# EAGLE design drawdio_v2 (EAGLE 9.0.1)
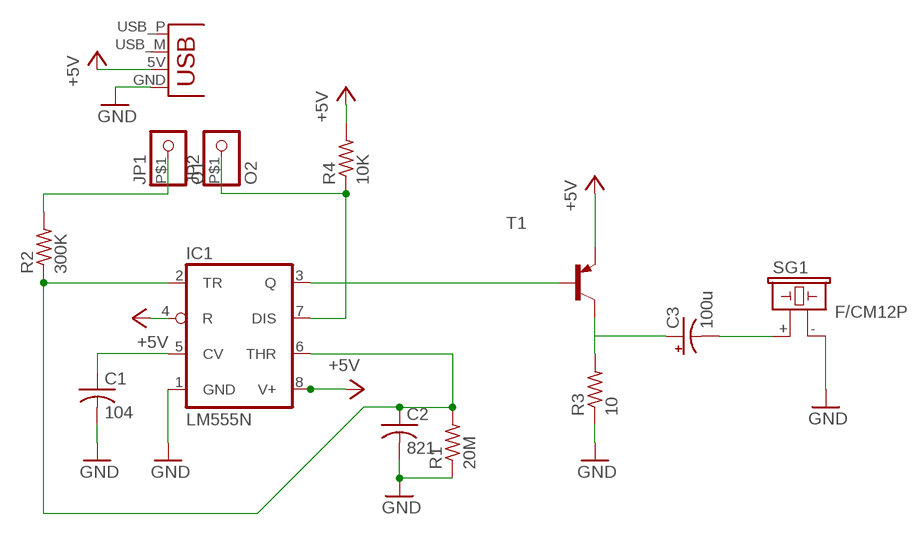
[diagram p0: schematic, sheet 1]

## Parts
C1  104  C-US025-030X050  [C025-030X050]
C2  821  C-US050-024X044  [C050-024X044]
C3  100u  CPOL-USE2,5-6E  [E2,5-6E]
IC1  LM555N  [DIL08]
JP1  O1  PINHD-1X1-BIGPOGO  [1X1-BIGPOGO]
JP2  O2  PINHD-1X1-BIGPOGO  [1X1-BIGPOGO]
R1  20M  R-US_0207/7  [0207/7]
R2  300K  R-US_0207/7  [0207/7]
R3  10  R-US_0207/7  [0207/7]
R4  10K  R-US_0207/7  [0207/7]
SG1  F/CM12P  [F/CM12P]
T1  MPS2907A-PNP-TO92-CBE  [TO92-CBE]
X1  USBPCB  [USB-A-PCB]

## Nets
+5V: IC1.4(R) IC1.8(V+) R4.2 T1.E X1.5V(VBUS)
GND: C1.2 C2.2 IC1.1(GND) R1.1 R3.1 SG1.- X1.GND
N$1: C1.1 IC1.5(CV)
N$2: C2.1 IC1.2(TR) IC1.6(THR) R1.2 R2.1
N$3: C3.- SG1.+
N$4: JP1.P$1 R2.2
N$5: IC1.7(DIS) JP2.P$1 R4.1
N$6: IC1.3(Q) T1.B
N$7: C3.+ R3.2 T1.C
Unconnected: X1.USB_M(D-) X1.USB_P(D+)

## Library data of the parts
C1 C2 = adafruit:C-US: CAPACITOR, American symbol
C3 = adafruit:CPOL-US: POLARIZED CAPACITOR, American symbol
IC1 = linear:*555: TIMER
JP1 JP2 = adafruit:PINHD-1X1: Pin header 1x1 for 0.1" spacing With round pins
R1-R4 = rcl:R-US_: RESISTOR, American symbol; SPICEPREFIX: R
SG1 = buzzer:F/CM12P: BUZZER Source: Buerklin; OC_FARNELL: unknown; OC_NEWARK: unknown
T1 = transistor:*-PNP-: PNP Transistror
X1 = SparkFun:USB: USB Connectors USB-B-PTH is fully proven SKU : PRT-00139 USB-miniB is fully proven SKU : PRT-00587 USB-A-PCB is untested. USB-A-H is throughly reviewed, but untested. Spark Fun Electronics SKU : PRT-00437 USB-B-SMT is throughly reviewed, but untested. Needs silkscreen touching up. USB-A-S has not been used/tested USB-MB-H has not been used/tested

## Board
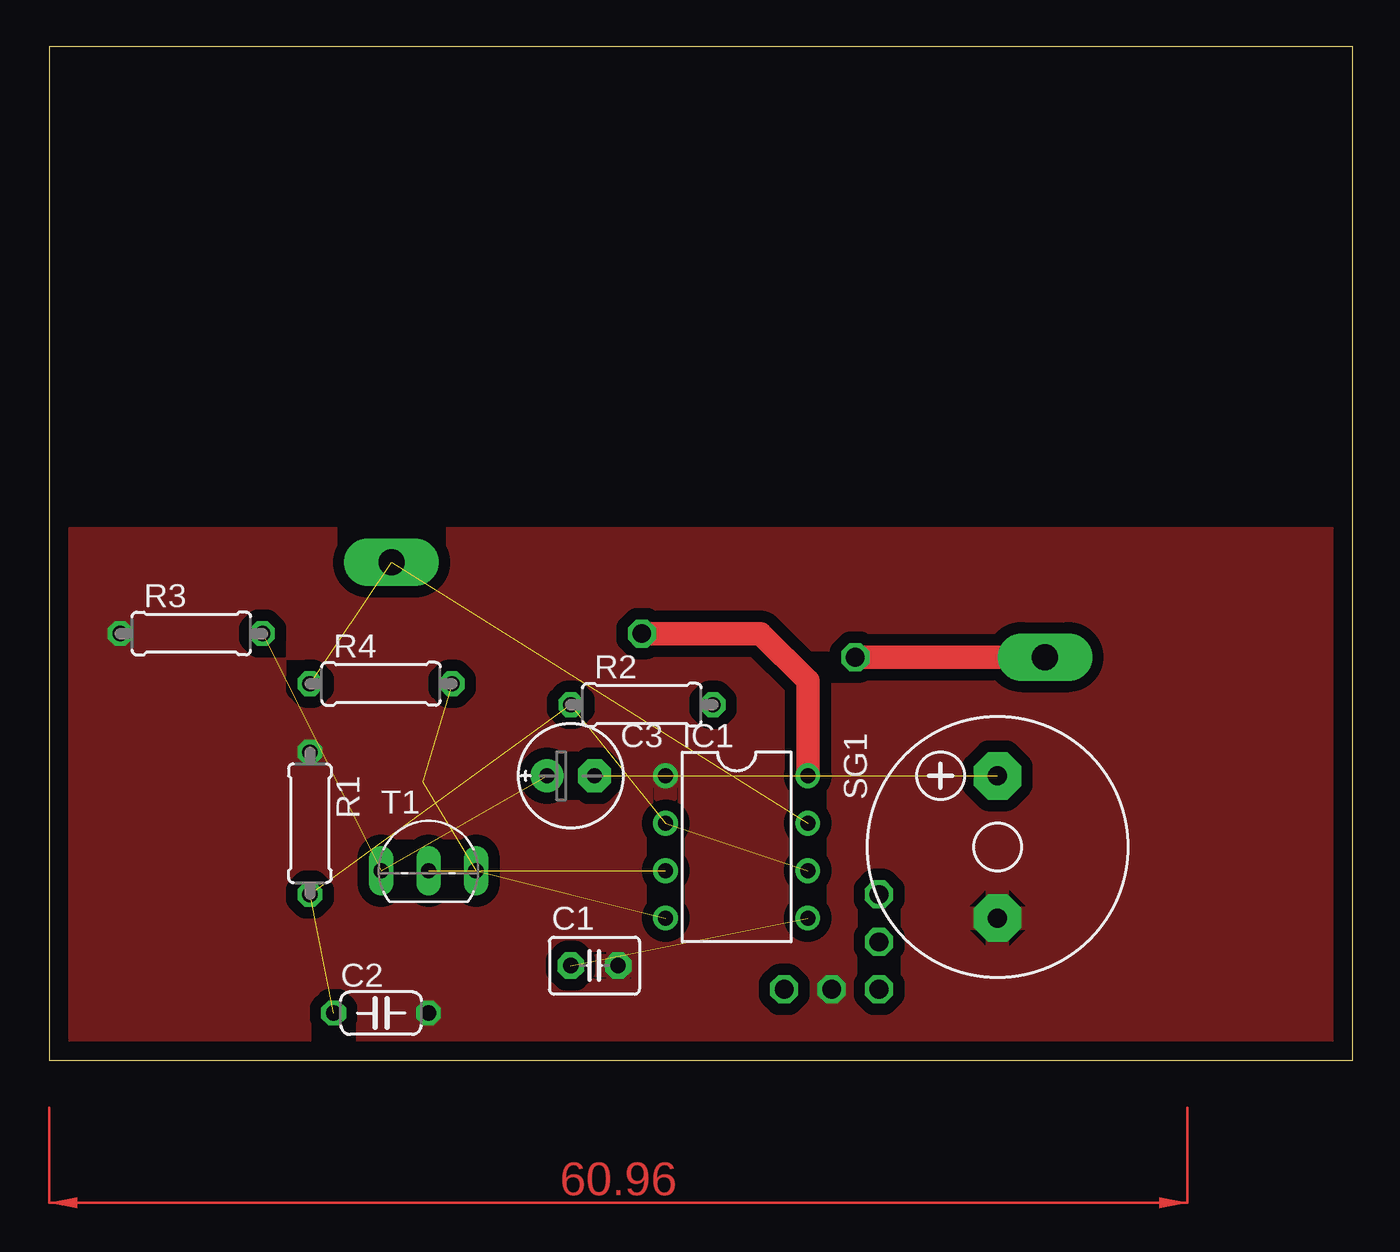
[diagram p1: board, top side]
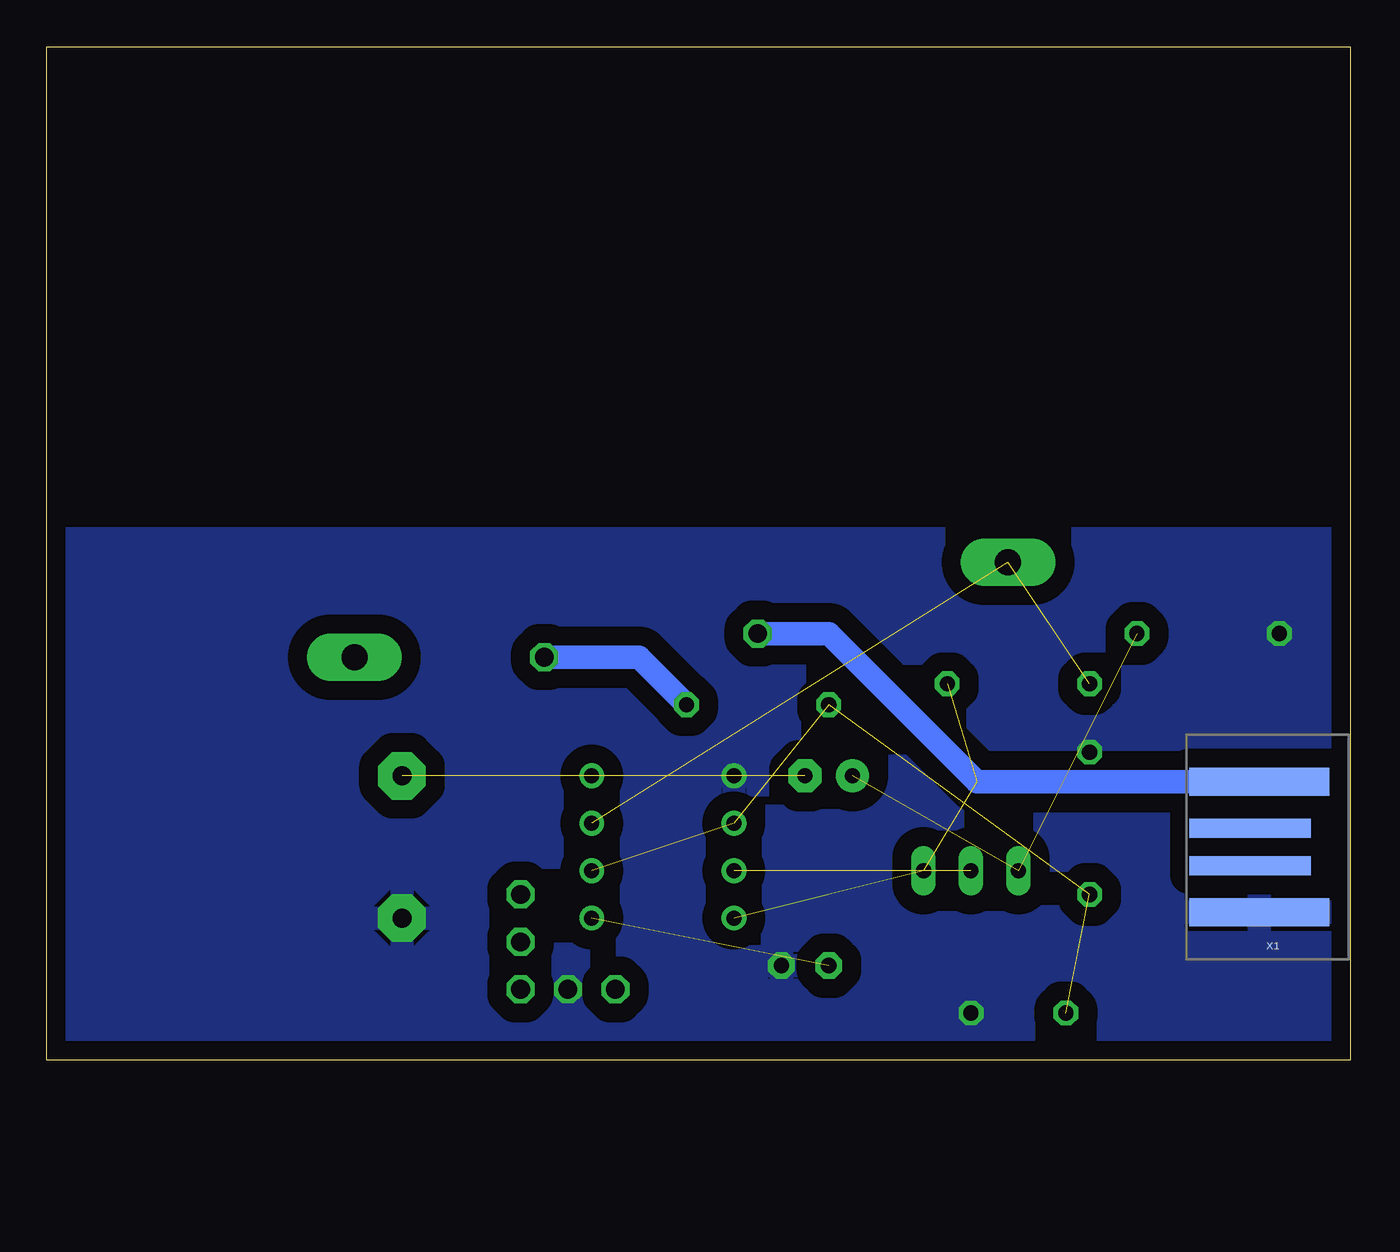
[diagram p2: board, bottom side, seen from below]

Size 69.83 x 54.28 mm. Coordinates in mm from the lower left corner, seen from the top.
Outline: 0,0 69.83,0 69.83,54.28 0,54.28 0,0
Copper layers (1*16): Top 0.035mm / dielectric 1.5mm / Bottom 0.035mm
Design rules "default": minimum track width 6mil, minimum drill 0.35mm, track to track 6mil, track to pad 6mil, pad to pad 6mil, via to via 6mil, smd to smd 6mil, copper to edge 40mil, drill to drill 6mil, minimum pad ring 10mil, minimum via ring 8mil, stop-mask expansion 4mil, vias tented up to drill 0mil, thermal gap 10mil

### Footprints (pad centres in the part's own frame; a part is rotated, then mirrored left to right if it is on the bottom)
C025-030X050 = drill 0.813 pad 1.422 octagon: 1 -1.27,0; 2 1.27,0
C050-024X044 = drill 0.813 octagon: 1 -2.54,0; 2 2.54,0
E2,5-6E = drill 0.813 pad 1.778: + -1.27,0 | drill 0.813 pad 1.778 octagon: - 1.27,0
DIL08 = drill 0.813 pad 1.27: 1 -3.81,-3.81; 2 -1.27,-3.81; 3 1.27,-3.81; 4 3.81,-3.81; 5 3.81,3.81; 6 1.27,3.81; 7 -1.27,3.81; 8 -3.81,3.81
1X1-BIGPOGO = drill 1.4 pad 2.54 long: P$1 0,0
0207/7 = drill 0.813 octagon: 1 -3.81,0; 2 3.81,0
F/CM12P = drill 1.016 pad 2.54 octagon: + 3.81,0; - -3.81,0
TO92-CBE = drill 0.813 long: B 0,0; C -2.54,0; E 2.54,0
USB-A-PCB = smd 7.5 x 1.5: 5V -0.2,-3.5; GND -0.2,3.5 | smd 6.5 x 1: USB_M 0.3,-1; USB_P 0.3,1

### Placement (x,y rotation side)
C1  29.21,5.08 0 top
C2  17.78,2.54 0 top
C3  27.94,15.24 0 top
IC1  36.83,11.43 270 top
JP1  53.34,21.59 0 top
JP2  18.34,26.67 0 top
R1  13.97,12.7 270 top
R2  31.75,19.05 0 top
R3  7.62,22.86 0 top
R4  17.78,20.17 0 top
SG1  50.8,11.43 90 top
T1  20.32,10.16 0 top
X1  5.08,11.43 180 bottom

### Tracks (layer width: path | path; a pad name or v marks a point on that pad's centre or on a via)
+5V  (via drill 1 pad 1.2)  (3 unrouted)
  Top 1.27: v31.75,22.86 38.1,22.86 40.64,20.32 IC1.8
  Bottom 1.27: X1.5V 20.01,14.93 27.94,22.86 v31.75,22.86
GND  (via drill 1 pad 1.2)
  other vias: 41.91,3.81
  pour Top (isolate 0.61): 0,0 69.85,0 69.85,27.94 0,27.94
  pour Bottom (isolate 1.016, rank 3): 0,0 69.85,0 69.85,27.94 0,27.94
N$1  (1 unrouted)
N$2  (4 unrouted)
N$3  (1 unrouted)
N$4  (via drill 1 pad 1)
  Top 1.27: JP1.P$1 v43.18,21.59
  Bottom 1.27: v43.18,21.59 38.1,21.59 R2.2
N$5  (2 unrouted)
N$6  (1 unrouted)
N$7  (2 unrouted)
N$8  (via drill 1 pad 1.2)
  other vias: 44.45,8.89
N$9  (via drill 1 pad 1.2)
  other vias: 44.45,6.35
N$10  (via drill 1 pad 1.2)
  other vias: 44.45,3.81
N$12  (via drill 1 pad 1.2)
  other vias: 39.37,3.81
(copper drawn outside any net)
  shapes: Top area x1